# Altium schematic sheet power.SchDoc
size A4; SheetNumber: 4; SheetTotal: 6
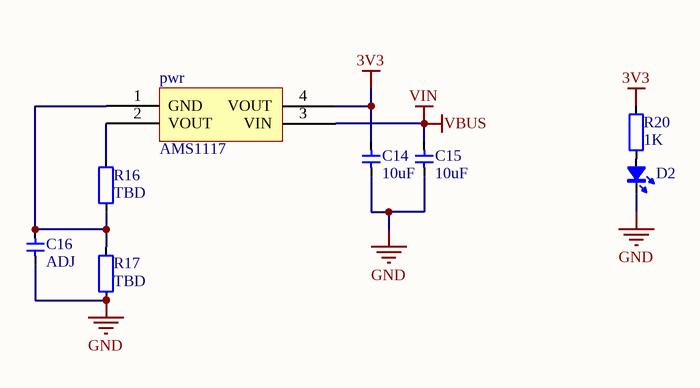
[diagram p0: power.SchDoc]

## Parts
C14  10uF  [C0603]
C15  10uF  [C0603]
C16  ADJ  [C0603]
D2  color?  [LED_0402_RED]  (value not drawn)
pwr  AMS1117  [SOT223_L]
R16  TBD  [R0603]
R17  TBD  [R0603]
R20  1K  [RES_0402]

## Nets
3V3: C14.2 pwr.4(VOUT) R20.1
GND: C14.1 C15.1 C16.1 D2.2(K) R17.2
VBUS: C15.2 pwr.3(VIN)  [also labelled VIN]
NetC16_2: C16.2 pwr.1(GND) R16.2 R17.1
NetD2_1: D2.1(A) R20.2
Netpwr_2: pwr.2(VOUT) R16.1

## Library data of the parts
C14-C16 = 电容-0402: Capacitor; Value: 0.1u
D2 = LED_0402: LED; Type: 0402; Value: color?
R16 R17 R20 = 电阻-0402: Resistor; Value: 22R